# Altium schematic sheet Motherboard Connectors and Memory.SchDoc: Laird RG191-M2 LoRa Concentrator Daughterboard
size Letter; DrawnBy: MTAN; Organization: Altium Limited; DocumentNumber: 2; Revision: A; SheetNumber: 2; SheetTotal: 2
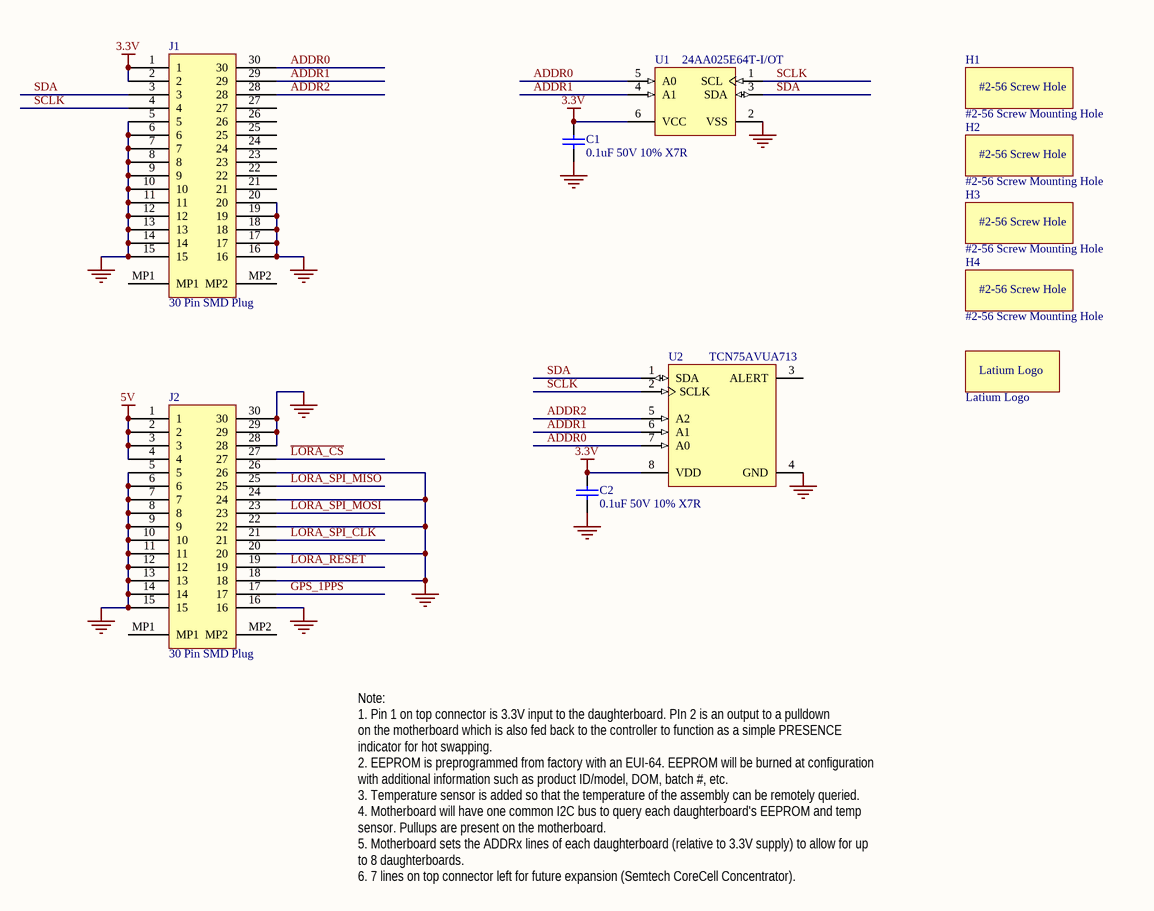
[diagram p0: Motherboard Connectors and Memory.SchDoc]

## Parts
C1  0.1uF 50V 10% X7R  [CAPC1005L]
C2  0.1uF 50V 10% X7R  [CAPC1005L]
H1  #2-56 Screw Mounting Hole  [2-56 Screw Mount]  (no BOM)
H2  #2-56 Screw Mounting Hole  [2-56 Screw Mount]  (no BOM)
H3  #2-56 Screw Mounting Hole  [2-56 Screw Mount]  (no BOM)
H4  #2-56 Screw Mounting Hole  [2-56 Screw Mount]  (no BOM)
H7  Latium Logo  [LatiumLogo]  (no BOM)
J1  30 Pin SMD Plug  [10132797-031100LF]
J2  30 Pin SMD Plug  [10132797-031100LF]
U1  24AA025E64T-I/OT  [MCHP-SOT-23-OT6_L]
U2  TCN75AVUA713  [MSOP-UA8_L]

## Nets
3.3V: C1.1 C2.1 J1.1 J1.2 U1.6(VCC) U2.8(VDD)
5V: J2.1 J2.2 J2.3 J2.4
GND: C1.2 C2.2 J1.5 J1.6 J1.7 J1.8 J1.9 J1.10 J1.11 J1.12 J1.13 J1.14 J1.15 J1.16 J1.17 J1.18 J1.19 J1.20 J2.5 J2.6 J2.7 J2.8 J2.9 J2.10 J2.11 J2.12 J2.13 J2.14 J2.15 J2.16 J2.18 J2.20 J2.22 J2.24 J2.26 J2.28 J2.29 J2.30 U1.2(VSS) U2.4(GND)
ADDR0: J1.30 U1.5(A0) U2.7(A0)
ADDR1: J1.29 U1.4(A1) U2.6(A1)
ADDR2: J1.28 U2.5(A2)
GPS_1PPS: J2.17
~{LORA_CS}: J2.27
LORA_RESET: J2.19
LORA_SPI_CLK: J2.21
LORA_SPI_MISO: J2.25
LORA_SPI_MOSI: J2.23
SCLK: J1.4 U1.1(SCL) U2.2(SCLK)
SDA: J1.3 U1.3(SDA) U2.1(SDA)

Not connected (* = marked no-connect by the designer): J1 21 22 23 24 25 26 27 MP1 MP2; J2 MP1 MP2; U2 3(ALERT)

## Notes on the sheet
- Note:
  1. Pin 1 on top connector is 3.3V input to the daughterboard. PIn 2 is an output to a pulldown
  on the motherboard which is also fed back to the controller to function as a simple PRESENCE
  indicator for hot swapping.
  2. EEPROM is preprogrammed from factory with an EUI-64. EEPROM will be burned at configuration
  with additional information such as product ID/model, DOM, batch #, etc.
  3. Temperature sensor is added so that the temperature of the assembly can be remotely queried.
  4. Motherboard will have one common I2C bus to query each daughterboard's EEPROM and temp
  sensor. Pullups are present on the motherboard.
  5. Motherboard sets the ADDRx lines of each daughterboard (relative to 3.3V supply) to allow for up
  to 8 daughterboards.
  6. 7 lines on top connector left for future expansion (Semtech CoreCell Concentrator).
- Title
- Drawn By:
- Date:
- Time:
- Revision:
- Sheet
- of
- The Latium Group of Companies
- 1312 10 Street
- Nisku, Alberta
- T9E 8K2
- Canada
- File:
- (in symbol #2-56 Screw Support) #2-56 Screw Hole

## Library data of the parts
C1 C2 = Cap: Capacitor; Value: 0.1uF 50V 10% X7R
H1-H4 = #2-56 Screw Support: Value: #2-56 Screw Mounting Hole
J1 J2 = Amphenol 30 Pos BergStak Plug: CONN PLUG 30POS SMD GOLD; Manufacturer: Amphenol ICC (FCI); Note: Mates with 10132798-031100LF receptacle 3mm between board height; Value: 30 Pin SMD Plug; Manufacturer Part Number: 10132797-031100LF; Supplier 1: Digi-Key; Supplier 1 Part Number: 609-5024-1-ND
U1 = 24AA025E64T-I/OT: IC EEPROM 2K I2C 400KHZ SOT23-6; Manufacturer: Microchip Technology; Value: 24AA025E64T-I/OT; Manufacturer Part Number: 24AA025E64T-I/OT; Supplier 1: Digi-Key; Supplier 1 Part Number: 24AA025E64T-I/OTCT-ND
U2 = TCN75AVUA713: SENSOR DIGITAL -40C-125C 8MSOP; Manufacturer: Microchip Technology; Value: TCN75AVUA713; Manufacturer Part Number: TCN75AVUA713; Supplier 1: Digi-Key; Supplier 1 Part Number: TCN75AVUA713CT-ND
H7 = Latium Logo: Value: Latium Logo